# Altium schematic sheet OurEDA-P1K_usb.SchDoc
size A4; SheetNumber: 6; SheetTotal: 7
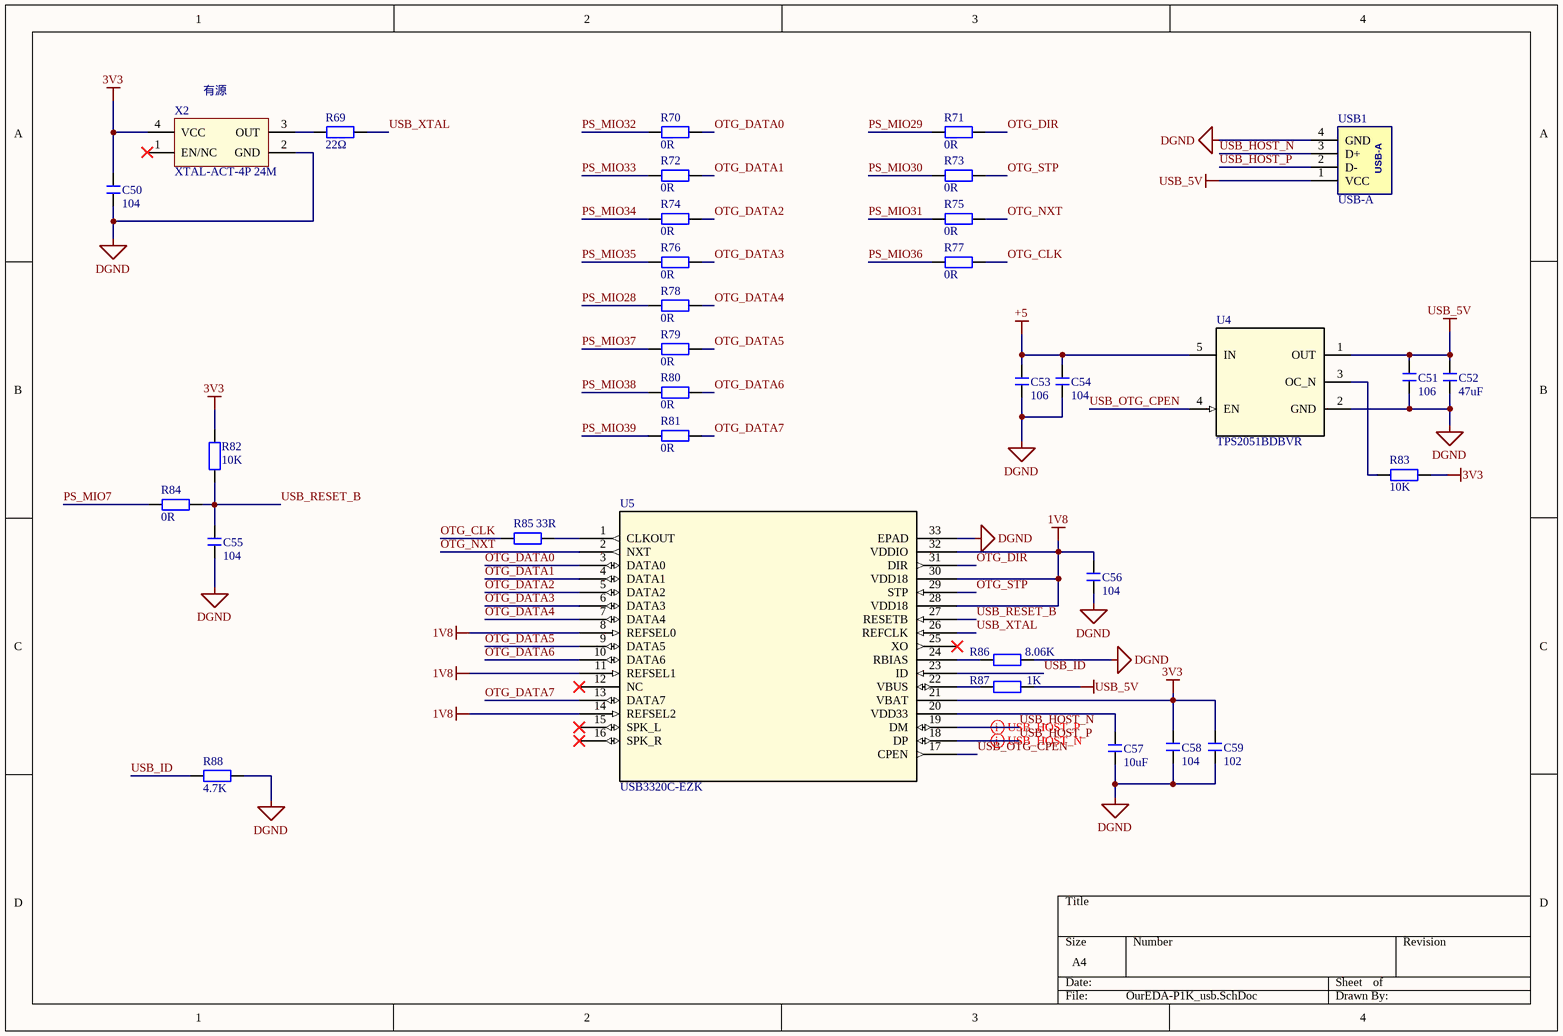
[diagram p0: OurEDA-P1K_usb.SchDoc]

## Parts
C50  104  [C 0603_L]
C51  106  [C 0603_L]
C52  47uF  [C 0603_L]
C53  106  [C 0603_L]
C54  104  [C 0603_L]
C55  104  [C 0603_L]
C56  104  [C 0603_L]
C57  10uF  [C 0603_L]
C58  104  [C 0603_L]
C59  102  [C 0603_L]
R69  22Ω  [R 0603_L]
R70  0R  [R 0603_L]
R71  0R  [R 0603_L]
R72  0R  [R 0603_L]
R73  0R  [R 0603_L]
R74  0R  [R 0603_L]
R75  0R  [R 0603_L]
R76  0R  [R 0603_L]
R77  0R  [R 0603_L]
R78  0R  [R 0603_L]
R79  0R  [R 0603_L]
R80  0R  [R 0603_L]
R81  0R  [R 0603_L]
R82  10K  [R 0603_L]
R83  10K  [R 0603_L]
R84  0R  [R 0603_L]
R85  33R  [R 0603_L]
R86  8.06K  [R 0603_L]
R87  1K  [R 0603_L]
R88  4.7K  [R 0603_L]
U4  TPS2051BDBVR  [DBV0005A_N]
U5  USB3320C-EZK  [QFN32_5X5MC_MCH]
USB1  USB-A  [USB-A/S_F]
X2  XTAL-ACT-4P 24M  [OSC 1612-4P]

## Nets
1V8: C56.2 U5.8(REFSEL0) U5.11(REFSEL1) U5.14(REFSEL2) U5.28(VDD18) U5.30(VDD18) U5.32(VDDIO)
3V3: C50.2 C58.2 C59.2 R82.2 R83.1 U5.21(VBAT) X2.4(VCC)
+5: C53.2 C54.2 U4.5(IN)
DGND: C50.1 C51.1 C52.1 C53.1 C54.1 C55.1 C56.1 C57.1 C58.1 C59.1 R86.2 R88.1 U4.2(GND) U5.33(EPAD) USB1.4(GND) X2.2(GND)
USB_5V: C51.2 C52.2 R87.2 U4.1(OUT) USB1.1(VCC)
OTG_CLK: R77.1 R85.1
OTG_DATA0: R70.1 U5.3(DATA0)
OTG_DATA1: R72.1 U5.4(DATA1)
OTG_DATA2: R74.1 U5.5(DATA2)
OTG_DATA3: R76.1 U5.6(DATA3)
OTG_DATA4: R78.1 U5.7(DATA4)
OTG_DATA5: R79.1 U5.9(DATA5)
OTG_DATA6: R80.1 U5.10(DATA6)
OTG_DATA7: R81.1 U5.13(DATA7)
OTG_DIR: R71.1 U5.31(DIR)
OTG_NXT: R75.1 U5.2(NXT)
OTG_STP: R73.1 U5.29(STP)
PS_MIO7: R84.2
PS_MIO28: R78.2
PS_MIO29: R71.2
PS_MIO30: R73.2
PS_MIO31: R75.2
PS_MIO32: R70.2
PS_MIO33: R72.2
PS_MIO34: R74.2
PS_MIO35: R76.2
PS_MIO36: R77.2
PS_MIO37: R79.2
PS_MIO38: R80.2
PS_MIO39: R81.2
USB_HOST_N: U5.19(DM) USB1.3(D+)
USB_HOST_P: U5.18(DP) USB1.2(D-)
USB_ID: R88.2 U5.23(ID)
USB_OTG_CPEN: U4.4(EN) U5.17(CPEN)
USB_RESET_B: C55.2 R82.1 R84.1 U5.27(RESETB)
USB_XTAL: R69.2 U5.26(REFCLK)
NetC57_2: C57.2 U5.20(VDD33)
NetR69_1: R69.1 X2.3(OUT)
NetR83_2: R83.2 U4.3(OC_N)
NetR85_2: R85.2 U5.1(CLKOUT)
NetR86_1: R86.1 U5.24(RBIAS)
NetR87_1: R87.1 U5.22(VBUS)

Not connected (* = marked no-connect by the designer): U5 12(NC)* 15(SPK_L)* 16(SPK_R)* 25(XO)*; X2 1(EN/NC)*

## Layout directives
differential pair: USB_HOST_N, USB_HOST_P

## Notes on the sheet
- (near X2) 有源

## Library data of the parts
C50-C59 = C: 无极性贴片电容; 版权归属: 源创客; BOM名称: 无极性贴片电容; 学习资源: www.ooocke.com
R69-R88 = R: 贴片电阻; 版权归属: 源创客; BOM名称: 贴片电阻; 学习资源: www.ooocke.com
U4 = TPS2051BDBVR: No Description Available; Mfr_Name: Texas Instruments; Alternate_PartNumber: TPS2051BDBVT; CompType: IC; Type: DEV; RefDes: RefDes; Copyright: Copyright (C) 2022 Ultra Librarian. All rights reserved.; Manufacturer_Part_Number: TPS2051BDBVR; Application_BuildNumber: *; PartNumber: TPS2051BDBVR; PackageReference: DBV0005A; MountType: SMT; RoHS: Y; Manufacturer: Texas Instruments
U5 = USB3320C-EZK: No Description Available; Mfr_Name: Microchip; Copyright: Copyright (C) 2022 Ultra Librarian. All rights reserved.; Manufacturer_Part_Number: USB3320C-EZK; RefDes: RefDes; Type: DEV
X2 = XTAL-ACT-4P: 4脚有源晶振